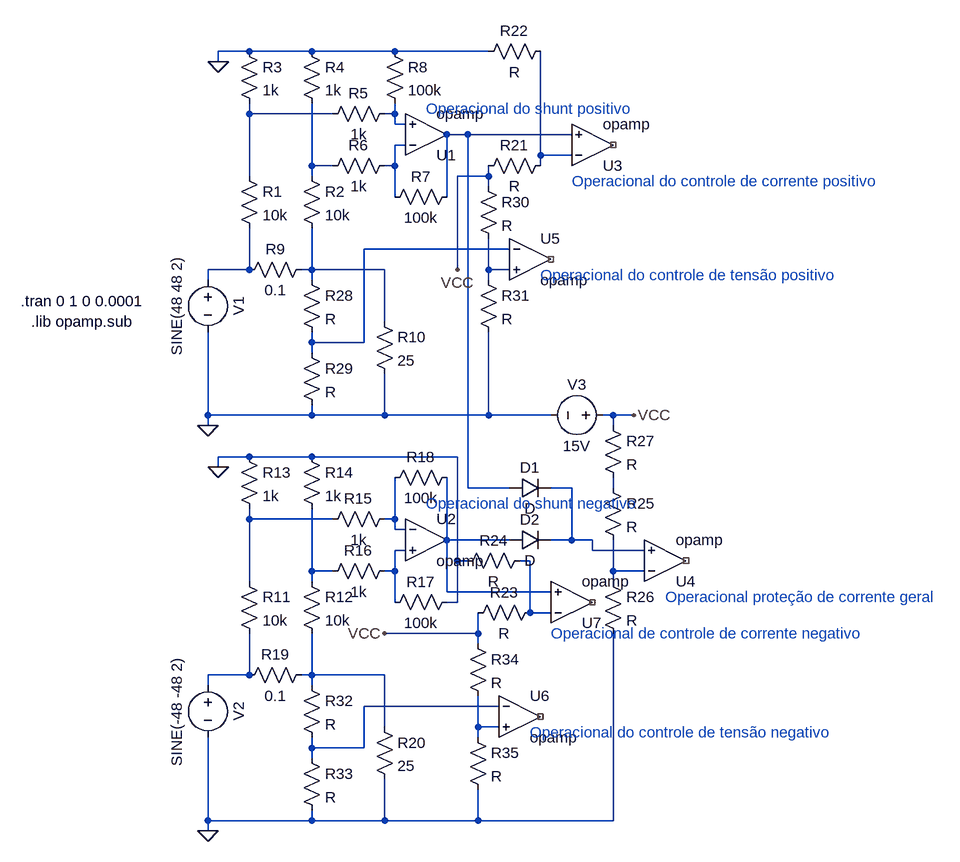
[diagram p0: schematic Draft3.asc]
Draft3.asc, the LTspice schematic file:
Version 4
SHEET 1 1016 1076
WIRE -80 -144 -128 -144
WIRE 16 -144 -80 -144
WIRE 144 -144 16 -144
WIRE 288 -144 144 -144
WIRE -128 -128 -128 -144
WIRE -80 -48 -80 -64
WIRE 48 -48 -80 -48
WIRE 144 -48 144 -64
WIRE 144 -48 128 -48
WIRE 144 -32 144 -48
WIRE 160 -32 144 -32
WIRE 256 -16 224 -16
WIRE 416 -16 256 -16
WIRE 160 0 144 0
WIRE 368 16 368 -144
WIRE 416 16 368 16
WIRE 16 32 16 -64
WIRE 48 32 16 32
WIRE 144 32 144 0
WIRE 144 32 128 32
WIRE 368 32 368 16
WIRE -80 48 -80 -48
WIRE 16 48 16 32
WIRE 288 48 288 32
WIRE 288 48 240 48
WIRE 288 64 288 48
WIRE 144 80 144 32
WIRE 224 80 224 -16
WIRE 320 160 96 160
WIRE -80 192 -80 128
WIRE -80 192 -144 192
WIRE 16 192 16 128
WIRE 16 192 0 192
WIRE 128 192 16 192
WIRE 240 192 240 48
WIRE 288 192 288 144
WIRE 320 192 288 192
WIRE -144 208 -144 192
WIRE 16 208 16 192
WIRE 288 208 288 192
WIRE 128 272 128 192
WIRE 16 304 16 288
WIRE 96 304 96 160
WIRE 96 304 16 304
WIRE 16 320 16 304
WIRE -144 416 -144 288
WIRE 16 416 16 400
WIRE 16 416 -144 416
WIRE 128 416 128 352
WIRE 128 416 16 416
WIRE 288 416 288 288
WIRE 288 416 128 416
WIRE 384 416 288 416
WIRE 480 416 464 416
WIRE 512 416 480 416
WIRE -144 432 -144 416
WIRE 480 432 480 416
WIRE -80 480 -128 480
WIRE 16 480 -80 480
WIRE 240 480 16 480
WIRE -128 496 -128 480
WIRE 256 528 256 -16
WIRE 320 528 256 528
WIRE 416 528 384 528
WIRE 480 528 480 512
WIRE -80 576 -80 560
WIRE 48 576 -80 576
WIRE 144 576 144 512
WIRE 144 576 128 576
WIRE 144 592 144 576
WIRE 160 592 144 592
WIRE 224 608 224 512
WIRE 320 608 224 608
WIRE 416 608 416 528
WIRE 416 608 384 608
WIRE 448 608 416 608
WIRE 160 624 144 624
WIRE 448 624 448 608
WIRE 528 624 448 624
WIRE 240 640 240 480
WIRE 256 640 240 640
WIRE 352 640 336 640
WIRE 16 656 16 560
WIRE 48 656 16 656
WIRE 144 656 144 624
WIRE 144 656 128 656
WIRE 480 656 480 608
WIRE 528 656 480 656
WIRE -80 672 -80 576
WIRE 16 672 16 656
WIRE 480 672 480 656
WIRE 224 688 224 608
WIRE 384 688 224 688
WIRE 144 704 144 656
WIRE 240 704 240 640
WIRE 240 704 224 704
WIRE 352 720 352 640
WIRE 384 720 352 720
WIRE 272 752 272 720
WIRE 272 752 128 752
WIRE 272 768 272 752
WIRE -80 816 -80 752
WIRE -80 816 -144 816
WIRE 16 816 16 752
WIRE 16 816 0 816
WIRE 128 816 16 816
WIRE -144 832 -144 816
WIRE 16 832 16 816
WIRE 304 864 96 864
WIRE 128 896 128 816
WIRE 272 896 272 848
WIRE 304 896 272 896
WIRE 272 912 272 896
WIRE 16 928 16 912
WIRE 96 928 96 864
WIRE 96 928 16 928
WIRE 16 944 16 928
WIRE -144 1040 -144 912
WIRE 16 1040 16 1024
WIRE 16 1040 -144 1040
WIRE 128 1040 128 976
WIRE 128 1040 16 1040
WIRE 272 1040 272 992
WIRE 272 1040 128 1040
WIRE 480 1040 480 752
WIRE 480 1040 272 1040
WIRE -144 1056 -144 1040
FLAG -128 -128 0
FLAG -144 432 0
FLAG -128 496 0
FLAG -144 1056 0
FLAG 240 192 VCC
FLAG 128 752 VCC
FLAG 512 416 VCC
SYMBOL OpAmps\\opamp 192 48 M180
SYMATTR InstName U1
SYMBOL res -96 32 R0
SYMATTR InstName R1
SYMATTR Value 10k
SYMBOL res 0 32 R0
SYMATTR InstName R2
SYMATTR Value 10k
SYMBOL res -96 -160 R0
SYMATTR InstName R3
SYMATTR Value 1k
SYMBOL res 0 -160 R0
SYMATTR InstName R4
SYMATTR Value 1k
SYMBOL res 144 -64 R90
WINDOW 0 0 56 VBottom 2
WINDOW 3 32 56 VTop 2
SYMATTR InstName R5
SYMATTR Value 1k
SYMBOL res 144 16 R90
WINDOW 0 0 56 VBottom 2
WINDOW 3 32 56 VTop 2
SYMATTR InstName R6
SYMATTR Value 1k
SYMBOL res 240 64 R90
WINDOW 0 0 56 VBottom 2
WINDOW 3 32 56 VTop 2
SYMATTR InstName R7
SYMATTR Value 100k
SYMBOL res 128 -160 R0
SYMATTR InstName R8
SYMATTR Value 100k
SYMBOL voltage -144 192 R0
WINDOW 0 32 56 VTop 2
WINDOW 3 -32 56 VBottom 2
WINDOW 123 0 0 Left 0
WINDOW 39 0 0 Left 0
SYMATTR InstName V1
SYMATTR Value SINE(48 48 2)
SYMBOL res 16 176 R90
WINDOW 0 0 56 VBottom 2
WINDOW 3 32 56 VTop 2
SYMATTR InstName R9
SYMATTR Value 0.1
SYMBOL res 112 256 R0
SYMATTR InstName R10
SYMATTR Value 25
SYMBOL OpAmps\\opamp 192 544 R0
SYMATTR InstName U2
SYMBOL res -96 656 R0
SYMATTR InstName R11
SYMATTR Value 10k
SYMBOL res 0 656 R0
SYMATTR InstName R12
SYMATTR Value 10k
SYMBOL res -96 464 R0
SYMATTR InstName R13
SYMATTR Value 1k
SYMBOL res 0 464 R0
SYMATTR InstName R14
SYMATTR Value 1k
SYMBOL res 144 560 R90
WINDOW 0 0 56 VBottom 2
WINDOW 3 32 56 VTop 2
SYMATTR InstName R15
SYMATTR Value 1k
SYMBOL res 144 640 R90
WINDOW 0 0 56 VBottom 2
WINDOW 3 32 56 VTop 2
SYMATTR InstName R16
SYMATTR Value 1k
SYMBOL res 240 688 R90
WINDOW 0 0 56 VBottom 2
WINDOW 3 32 56 VTop 2
SYMATTR InstName R17
SYMATTR Value 100k
SYMBOL res 240 496 R90
WINDOW 0 0 56 VBottom 2
WINDOW 3 32 56 VTop 2
SYMATTR InstName R18
SYMATTR Value 100k
SYMBOL voltage -144 816 R0
WINDOW 0 32 56 VTop 2
WINDOW 3 -32 56 VBottom 2
WINDOW 123 0 0 Left 0
WINDOW 39 0 0 Left 0
SYMATTR InstName V2
SYMATTR Value SINE(-48 -48 2)
SYMBOL res 16 800 R90
WINDOW 0 0 56 VBottom 2
WINDOW 3 32 56 VTop 2
SYMATTR InstName R19
SYMATTR Value 0.1
SYMBOL res 112 880 R0
SYMATTR InstName R20
SYMATTR Value 25
SYMBOL OpAmps\\opamp 560 704 M180
SYMATTR InstName U4
SYMBOL res 464 512 R0
SYMATTR InstName R25
SYMBOL res 464 656 R0
SYMATTR InstName R26
SYMBOL res 464 416 R0
SYMATTR InstName R27
SYMBOL voltage 480 416 R90
WINDOW 0 -32 56 VBottom 2
WINDOW 3 32 56 VTop 2
WINDOW 123 0 0 Left 0
WINDOW 39 0 0 Left 0
SYMATTR InstName V3
SYMATTR Value 15V
SYMBOL OpAmps\\opamp 352 112 R0
SYMATTR InstName U5
SYMBOL OpAmps\\opamp 336 816 R0
SYMATTR InstName U6
SYMBOL res 0 192 R0
SYMATTR InstName R28
SYMBOL res 0 304 R0
SYMATTR InstName R29
SYMBOL res 272 48 R0
SYMATTR InstName R30
SYMBOL res 272 192 R0
SYMATTR InstName R31
SYMBOL res 0 816 R0
SYMATTR InstName R32
SYMBOL res 0 928 R0
SYMATTR InstName R33
SYMBOL res 256 752 R0
SYMATTR InstName R34
SYMBOL res 256 896 R0
SYMATTR InstName R35
SYMBOL diode 320 544 R270
WINDOW 0 32 32 VTop 2
WINDOW 3 0 32 VBottom 2
SYMATTR InstName D1
SYMBOL diode 320 624 R270
WINDOW 0 32 32 VTop 2
WINDOW 3 0 32 VBottom 2
SYMATTR InstName D2
SYMBOL OpAmps\\opamp 448 64 M180
SYMATTR InstName U3
SYMBOL res 384 16 R90
WINDOW 0 0 56 VBottom 2
WINDOW 3 32 56 VTop 2
SYMATTR InstName R21
SYMBOL res 384 -160 R90
WINDOW 0 0 56 VBottom 2
WINDOW 3 32 56 VTop 2
SYMATTR InstName R22
SYMBOL OpAmps\\opamp 416 768 M180
SYMATTR InstName U7
SYMBOL res 368 704 R90
WINDOW 0 0 56 VBottom 2
WINDOW 3 32 56 VTop 2
SYMATTR InstName R23
SYMBOL res 352 624 R90
WINDOW 0 0 56 VBottom 2
WINDOW 3 32 56 VTop 2
SYMATTR InstName R24
TEXT -432 240 Left 2 !.tran 0 1 0 0.0001
TEXT -416 272 Left 2 !.lib opamp.sub
TEXT 192 -56 Left 2 ;Operacional do shunt positivo
TEXT 192 552 Left 2 ;Operacional do shunt negativo
TEXT 368 200 Left 2 ;Operacional do controle de tensão positivo
TEXT 352 904 Left 2 ;Operacional do controle de tensão negativo
TEXT 560 696 Left 2 ;Operacional proteção de corrente geral
TEXT 416 56 Left 2 ;Operacional do controle de corrente positivo
TEXT 384 752 Left 2 ;Operacional de controle de corrente negativo

The netlist it stands for:
* Draft3.asc
XU1 N004 N002 N003 opamp Aol=100K GBW=10Meg  ; pins invin noninvin out
R1 N001 N008 10k
R2 N006 N009 10k
R3 0 N001 1k
R4 0 N006 1k
R5 N002 N001 1k
R6 N004 N006 1k
R7 N003 N004 100k
R8 0 N002 100k
V1 N008 0 SINE(48 48 2)
R9 N009 N008 0.1
R10 N009 0 25
XU2 N014 N016 N015 opamp Aol=100K GBW=10Meg  ; pins invin noninvin out
R11 N013 N020 10k
R12 N018 N021 10k
R13 0 N013 1k
R14 0 N018 1k
R15 N014 N013 1k
R16 N016 N018 1k
R17 0 N016 100k
R18 N015 N014 100k
V2 N020 0 SINE(-48 -48 2)
R19 N021 N020 0.1
R20 N021 0 25
XU4 N019 N011 NC_01 opamp Aol=100K GBW=10Meg  ; pins invin noninvin out
R25 N012 N019 R
R26 N019 0 R
R27 VCC N012 R
V3 VCC 0 15V
XU5 N007 N010 NC_02 opamp Aol=100K GBW=10Meg  ; pins invin noninvin out
XU6 N022 N023 NC_03 opamp Aol=100K GBW=10Meg  ; pins invin noninvin out
R28 N009 N007 R
R29 N007 0 R
R30 VCC N010 R
R31 N010 0 R
R32 N021 N022 R
R33 N022 0 R
R34 VCC N023 R
R35 N023 0 R
D1 N003 N011 D
D2 N015 N011 D
XU3 N005 N003 NC_04 opamp Aol=100K GBW=10Meg  ; pins invin noninvin out
R21 N005 VCC R
R22 N005 0 R
XU7 N017 N015 NC_05 opamp Aol=100K GBW=10Meg  ; pins invin noninvin out
R23 N017 VCC R
R24 N017 0 R
.model D D
.lib standard.dio
.tran 0 1 0 0.0001
.lib opamp.sub
* Operacional do shunt positivo
* Operacional do shunt negativo
* Operacional do controle de tensão positivo
* Operacional do controle de tensão negativo
* Operacional proteção de corrente geral
* Operacional do controle de corrente positivo
* Operacional de controle de corrente negativo
.backanno
.end